# Altium project LED_Project.PrjPcb
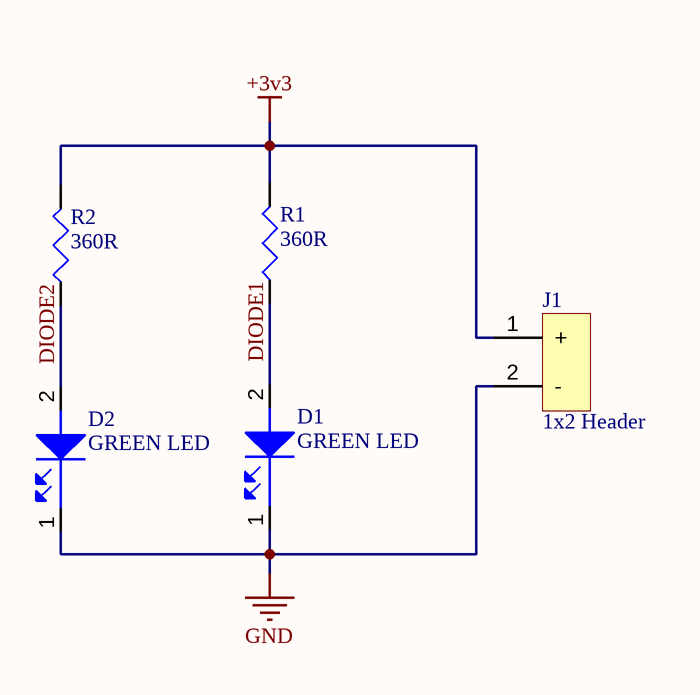
[diagram p0: LED.SchDoc]
1 sheet, 5 parts. Net scope: global (net labels, ports and power ports of the same name join across sheets).
Board file: LED.PcbDoc

## Sheet LED.SchDoc
size 594 x 420 mm

### Parts
D1  GREEN LED  [LED0603G]
D2  GREEN LED  [LED0603G]
J1  1x2 Header  [HEADER1x2]
R1  360R  [R0805]
R2  360R  [R0805]

### Nets
+3v3: J1.1(+) R1.2 R2.2
GND: D1.1 D2.1 J1.2(-)
DIODE1: D1.2 R1.1
DIODE2: D2.2 R2.1

### Notes on the sheet
- DWG NO:
- REV:
- THIS DOCUMENT AND THE DATA DISCLOSED HEREIN OR
- HEREWITH IS THE PROPERTY OF ALTIUM LIMITED AND MAY
- BE FREELY DISTRIBUTED IN WHOLE. NO RIGHTS ARE
- RESERVED OR EXPRESS OR IMPLIED WARANTEE GIVEN.
- REVISION
- DESCRIPTION
- DATE
- APPROVED
- ENG:
- APPROVALS
- PROJECT
- DSN:
- CHK:
- REFERENCE DOCUMENTS
- PROJECT REVISION:
- TITLE
- DOCUMENT REVISION:
- DESIGN ITEM:
- BOM:
- FAB DWG:
- PCB DWG:
- ASSY DWG:
- SCALE:
- A2
- SIZE
- CAGE CODE
- FILE NAME
- DWG NO.
- SHEET
- OF
- REV

### Library data of the parts
D1 D2 = LNJ337W83RA: LED GREEN 0603 SMD; Manufacturer: Panasonic SSG; Color: Green,Yellow; Luminous Intensity: 7.5mcd; Forward Voltage: 1.95V; Wavelength: 572nm; Forward Current: 20mA; Power Rating: 55mW; Test Current: 5mA; Lens Style: Rectangular; Number of LEDs: 1; Reverse Voltage: 4V; Supplier 1: Digi-Key; RoHS: Yes; Mount: Surface Mount; Case/Package: 0603; Number of Pins: 2; Case Code (Metric): 1608; Case Code (Imperial): 0603; Min Operating Temperature: -30°C; Max Operating Temperature: 85°C; Package Quantity: 5000; Packaging: Cut Tape; Illumination Color: Green; Dominant Wavelength: 572nm; Max Power Dissipation: 55mW; Series: LN; Reverse Voltage (DC): 4V; Length: 1.6mm; Width: 0.8mm; Height: 0.2mm; REACH SVHC: Yes; Lead Free: Lead Free; RoHS Compliant: Yes; ComponentLink1URL: https://datasheet.ciiva.com/6868/lnj337w83ra-aek-6868817.pdf?src-supplier=Newark; ComponentLink1Description: https://datasheet.ciiva.com/6868/lnj337w83ra-aek-6868817.pdf?src-supplier=Newark; ComponentLink2URL: https://datasheet.ciiva.com/4690/lnj337w83ra-aek-226051-4690026.pdf?src-supplier=Mouser; ComponentLink2Description: https://datasheet.ciiva.com/4690/lnj337w83ra-aek-226051-4690026.pdf?src-supplier=Mouser; ComponentLink3URL: https://datasheet.ciiva.com/11775/0900766b80f0a8bb-11775418.pdf?src-supplier=RSComponents; ComponentLink3Description: https://datasheet.ciiva.com/11775/0900766b80f0a8bb-11775418.pdf?src-supplier=RSComponents; Manufacturer Part Number: LNJ337W83RA; Supplier Part Number 1: LNJ337W83RACT-ND; Category: Optoelectronics
J1 = 22-29-2021: KK 254 Wire-to-Board Header, Vertical, with Friction Lock, 2 Circuits, Gold (Au) Plating; Manufacturer: Molex; Supplier 1: Digi-Key; Manufacturer Part Number: 22-29-2021; RoHS: Yes; Category: Connectors; Pricing 1: 1=0.48000, 10=0.40400, 100=0.31400, 1000=0.24671, 5000=0.21680, 10000=0.20185 (USD); ComponentLink1URL: https://datasheet.ciiva.com/70131/022292021-sd-70131706.pdf?src-supplier=Digi-Key; ComponentLink1Description: https://datasheet.ciiva.com/70131/022292021-sd-70131706.pdf?src-supplier=Digi-Key; Supplier Part Number 1: WM2744-ND
R1 R2 = CRCW0805360RFKEA: Res Thick Film 0805 360 Ohm 1% 1/8W ±100ppm/°C Molded SMD SMD Paper T/R; Manufacturer: Vishay; Number of Terminals/Pins: 2; Max Power Dissipation: 125mW; Voltage Rating (DC): 150V; Supplier 1: Digi-Key; Manufacturer Part Number: CRCW0805360RFKEA; RoHS: Yes; Category: Chip SMD Resistors; Pricing 1: 1=0.10000, 10=0.06700, 100=0.02710, 1000=0.01219, 2500=0.01058 (USD); Case/Package: 0805; Number of Pins: 2; Case Code (Metric): 2012; Case Code (Imperial): 0805; Contact Plating: Tin; Weight: 0.000194oz; Min Operating Temperature: -55°C; Max Operating Temperature: 155°C; Resistance: 360R; Tolerance: 1%; Packaging: Cut Tape; Resistor Type: Thick Film; Package Quantity: 5000; Number of Terminations: 2; Temperature Coefficient: 100ppm/°C; Features: Automotive AEC-Q200; Power Rating: 125mW; Voltage Rating: 150V; Termination: SMD/SMT; Series: D/CRCW E3; Technology: THICK FILM; Length: 2mm; Width: 1.25mm; Height: 0.45mm; Depth: 1.25mm; Radiation Hardening: No; Lead Free: Lead Free; REACH SVHC: Unknown; Military Standard: Not; RoHS Compliant: Yes; ComponentLink1URL: https://datasheet.ciiva.com/2467/dcrcwe3-2467773.pdf?src-supplier=Digi-Key; ComponentLink1Description: https://datasheet.ciiva.com/2467/dcrcwe3-2467773.pdf?src-supplier=Digi-Key; Supplier Part Number 1: 541-360CDKR-ND

## Assembly variants
LED2 Not Fitted: not fitted D2 R2